# EAGLE design Flying5 (EAGLE 7.5.0)
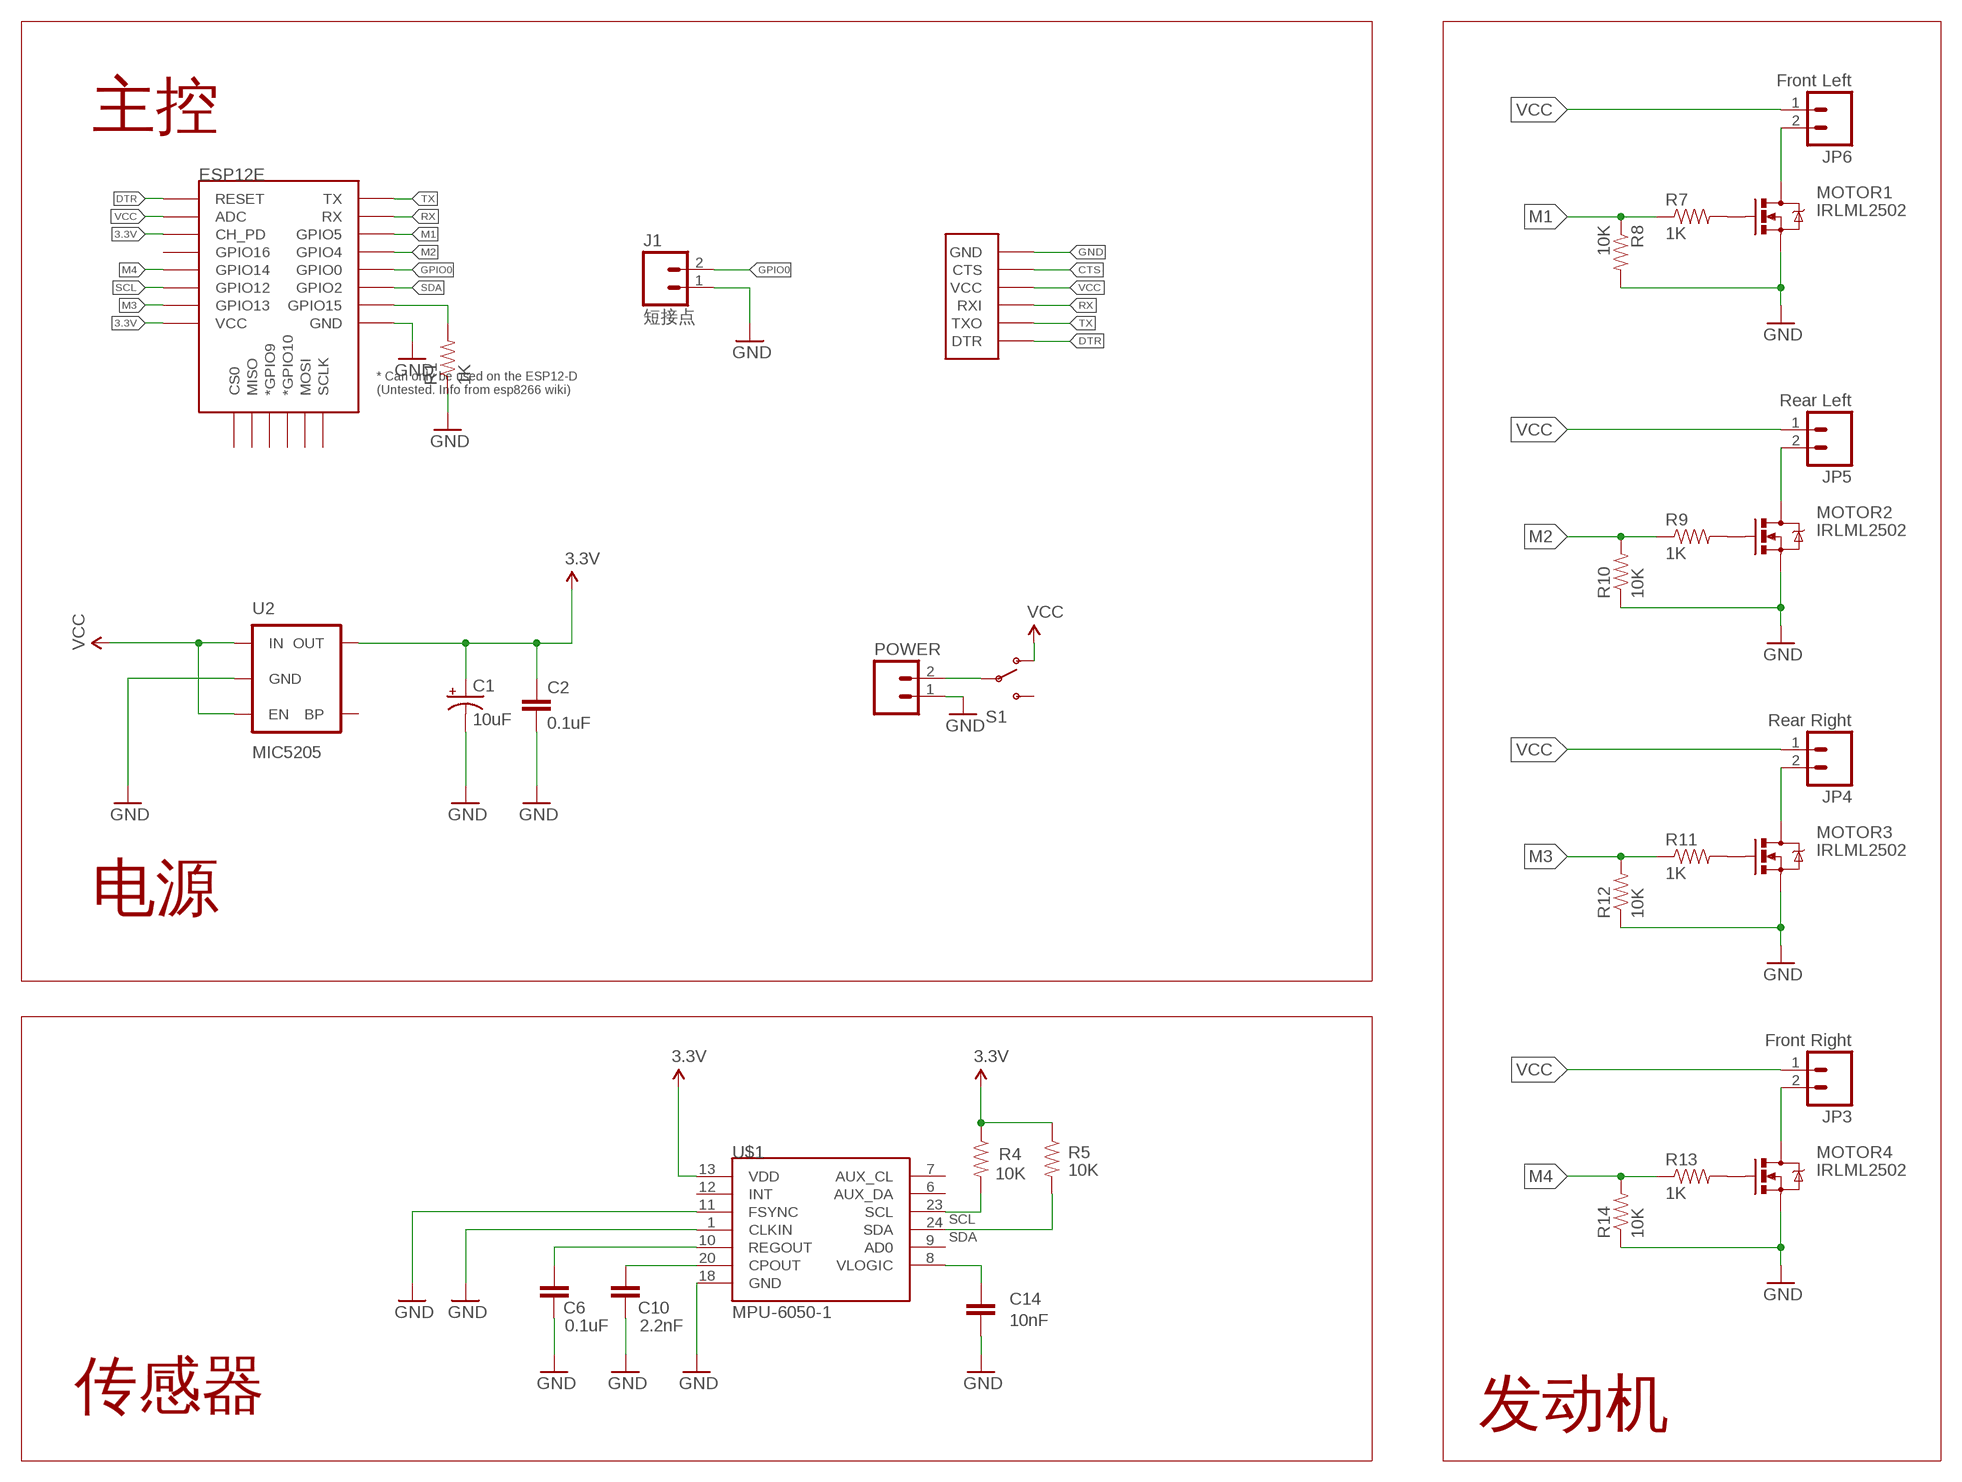
[diagram p0: schematic, sheet 1]

## Parts
C1  10uF  CAP_POL1206  [EIA3216]
C2  0.1uF  CAP0402-CAP  [0402-CAP]
C6  0.1uF  CAP0402-CAP  [0402-CAP]
C10  2.2nF  CAP0402-CAP  [0402-CAP]
C14  10nF  CAP0402-CAP  [0402-CAP]
ESP12E  ESP12ESMD  [ESP12E-SMD]
FTDI  FTDI_DEVICE  [FTDI_DEVICE_SIDE]
J1  短接点  M02PTH  [1X02]
JP3  Front Right  M02PTH3  [1X02_LONGPADS]
JP4  Rear Right  M02PTH3  [1X02_LONGPADS]
JP5  Rear Left  M02PTH3  [1X02_LONGPADS]
JP6  Front Left  M02PTH3  [1X02_LONGPADS]
MOTOR1  IRLML2502  MOSFET-NCHANNELBSS138  [SOT23]
MOTOR2  IRLML2502  MOSFET-NCHANNELBSS138  [SOT23]
MOTOR3  IRLML2502  MOSFET-NCHANNELBSS138  [SOT23]
MOTOR4  IRLML2502  MOSFET-NCHANNELBSS138  [SOT23]
POWER  M02PTH  [1X02]
R1  1K  RESISTOR0402-RES  [0402-RES]
R4  10K  RESISTOR0402-RES  [0402-RES]
R5  10K  RESISTOR0402-RES  [0402-RES]
R7  1K  RESISTOR0402-RES  [0402-RES]
R8  10K  RESISTOR0402-RES  [0402-RES]
R9  1K  RESISTOR0402-RES  [0402-RES]
R10  10K  RESISTOR0402-RES  [0402-RES]
R11  1K  RESISTOR0402-RES  [0402-RES]
R12  10K  RESISTOR0402-RES  [0402-RES]
R13  1K  RESISTOR0402-RES  [0402-RES]
R14  10K  RESISTOR0402-RES  [0402-RES]
S1  SWITCH-SPDT-SMD-A  [SWITCH-SPST-SMD-A]
U2  MIC5205  MIC52055V  [SOT23-5]
U$1  MPU-6050-1  [QFN-24-4MM2]

## Nets
3.3V: C1.A(+) C2.1 ESP12E.CH_PD ESP12E.VCC R4.1 R5.1 U2.5(OUT) U$1.13(VDD)
CTS: FTDI.P$5(CTS)
DTR: ESP12E.RESET FTDI.P$1(DTR)
GND: C1.C(-) C2.2 C6.1 C10.1 C14.1 ESP12E.GND FTDI.P$6(GND) J1.1 MOTOR1.2(S) MOTOR2.2(S) MOTOR3.2(S) MOTOR4.2(S) POWER.1 R1.1 R8.2 R10.1 R12.1 R14.1 U2.2(GND) U$1.1(CLKIN) U$1.11(FSYNC) U$1.18(GND)
GPIO0: ESP12E.GPIO0 J1.2
M1: ESP12E.GPIO5 R7.1 R8.1
M2: ESP12E.GPIO4 R9.1 R10.2
M3: ESP12E.GPIO13 R11.1 R12.2
M4: ESP12E.GPIO14 R13.1 R14.2
N$3: JP3.2 MOTOR4.3(D)
N$5: C14.2 U$1.8(VLOGIC)
N$6: POWER.2 S1.2(P)
N$8: JP4.2 MOTOR3.3(D)
N$12: JP5.2 MOTOR2.3(D)
N$14: JP6.2 MOTOR1.3(D)
N$16: ESP12E.GPIO15 R1.2
N$29: C6.2 U$1.10(REGOUT)
N$32: C10.2 U$1.20(CPOUT)
N$38: MOTOR1.1(G) R7.2
N$39: MOTOR2.1(G) R9.2
N$40: MOTOR3.1(G) R11.2
N$41: MOTOR4.1(G) R13.2
RX: ESP12E.RXD0(RX) FTDI.P$3(RXI)
SCL: ESP12E.GPIO12 R4.2 U$1.23(SCL)
SDA: ESP12E.GPIO2 R5.2 U$1.24(SDA)
TX: ESP12E.TXD0(TX) FTDI.P$2(TXO)
VCC: ESP12E.ADC FTDI.P$4(VCC) JP3.1 JP4.1 JP5.1 JP6.1 S1.1(O) U2.1(IN) U2.3(EN)
Unconnected: ESP12E.CS0 ESP12E.GPIO9(*GPIO9) ESP12E.GPIO10(*GPIO10) ESP12E.GPIO16 ESP12E.MISO ESP12E.MOSI ESP12E.SCLK S1.3(S) U2.4(BP) U$1.6(AUX_DA) U$1.7(AUX_CL) U$1.9(AD0) U$1.12(INT)

## Notes on the sheet
- 主控
- 电源
- 传感器 | 发动机

## Library data of the parts
C1 = SparkFun-Capacitors:CAP_POL: Capacitor Polarized These are standard SMD and PTH capacitors. Normally 10uF, 47uF, and 100uF in electrolytic and tantalum varieties. Always verify the external diameter of the through hole cap, it varies with capacity, voltage, and manufacturer. The EIA devices should be standard.
C2 C6 C10 C14 = SparkFun-Capacitors:CAP: Capacitor Standard 0603 ceramic capacitor, and 0.1" leaded capacitor.
ESP12E = esp8266modules:ESP12E: ESP12E Module
FTDI = SparkFun-Connectors:FTDI_DEVICE: Connector which mates to FTDI basic or FTDI cable.
J1 JP3-JP6 POWER = SparkFun-Connectors:M02: Standard 2-pin 0.1" header. Use with - straight break away headers ( PRT-00116) - right angle break away headers (PRT-00553) - swiss pins (PRT-00743) - machine pins (PRT-00117) - female headers (PRT-00115) Molex polarized connector foot print use with: PRT-08233 with associated crimp pins and housings. 2.54_SCREWTERM for use with PRT-10571. 3.5mm Screw Terminal footprints for PRT-08084 5mm Screw Terminal footprints for use with PRT-08432
MOTOR1-MOTOR4 = SparkFun-DiscreteSemi:MOSFET-NCHANNEL: Common NMOSFET Parts MFG P/N Store ID Prod ID FDD8780 TRANS-09984 SI7820DN TRANS-11055 FDS6630A IC-08089 2N7002PW TRANS-11151 FQP30N06L COM-10213 TRANS-10060 BSS123LT1G TRANS-08345 BSS138 TRANS-00830 BS170 2N7000; PROD_ID: TRANS-00830
R1 R4 R5 R7-R14 = SparkFun-Passives:RESISTOR: Resistor Basic schematic elements and footprints for 0603, 1206, and PTH resistors.
S1 = SparkFun-Electromechanical:SWITCH-SPDT: SPDT Switch Simple slide switch, Spark Fun Electronics SKU : COM-00102 DPDT SMT slide switch, AYZ0202, SWCH-08179; PROD_ID: SWCH-10651
U2 = SparkFun-PowerIC:MIC5205: MIC5205 150mA vreg 3.3V - VREG-00822 5V - VREG-00823; PROD_ID: VREG-00823
U$1 = Testing:MPU-6050

## Board
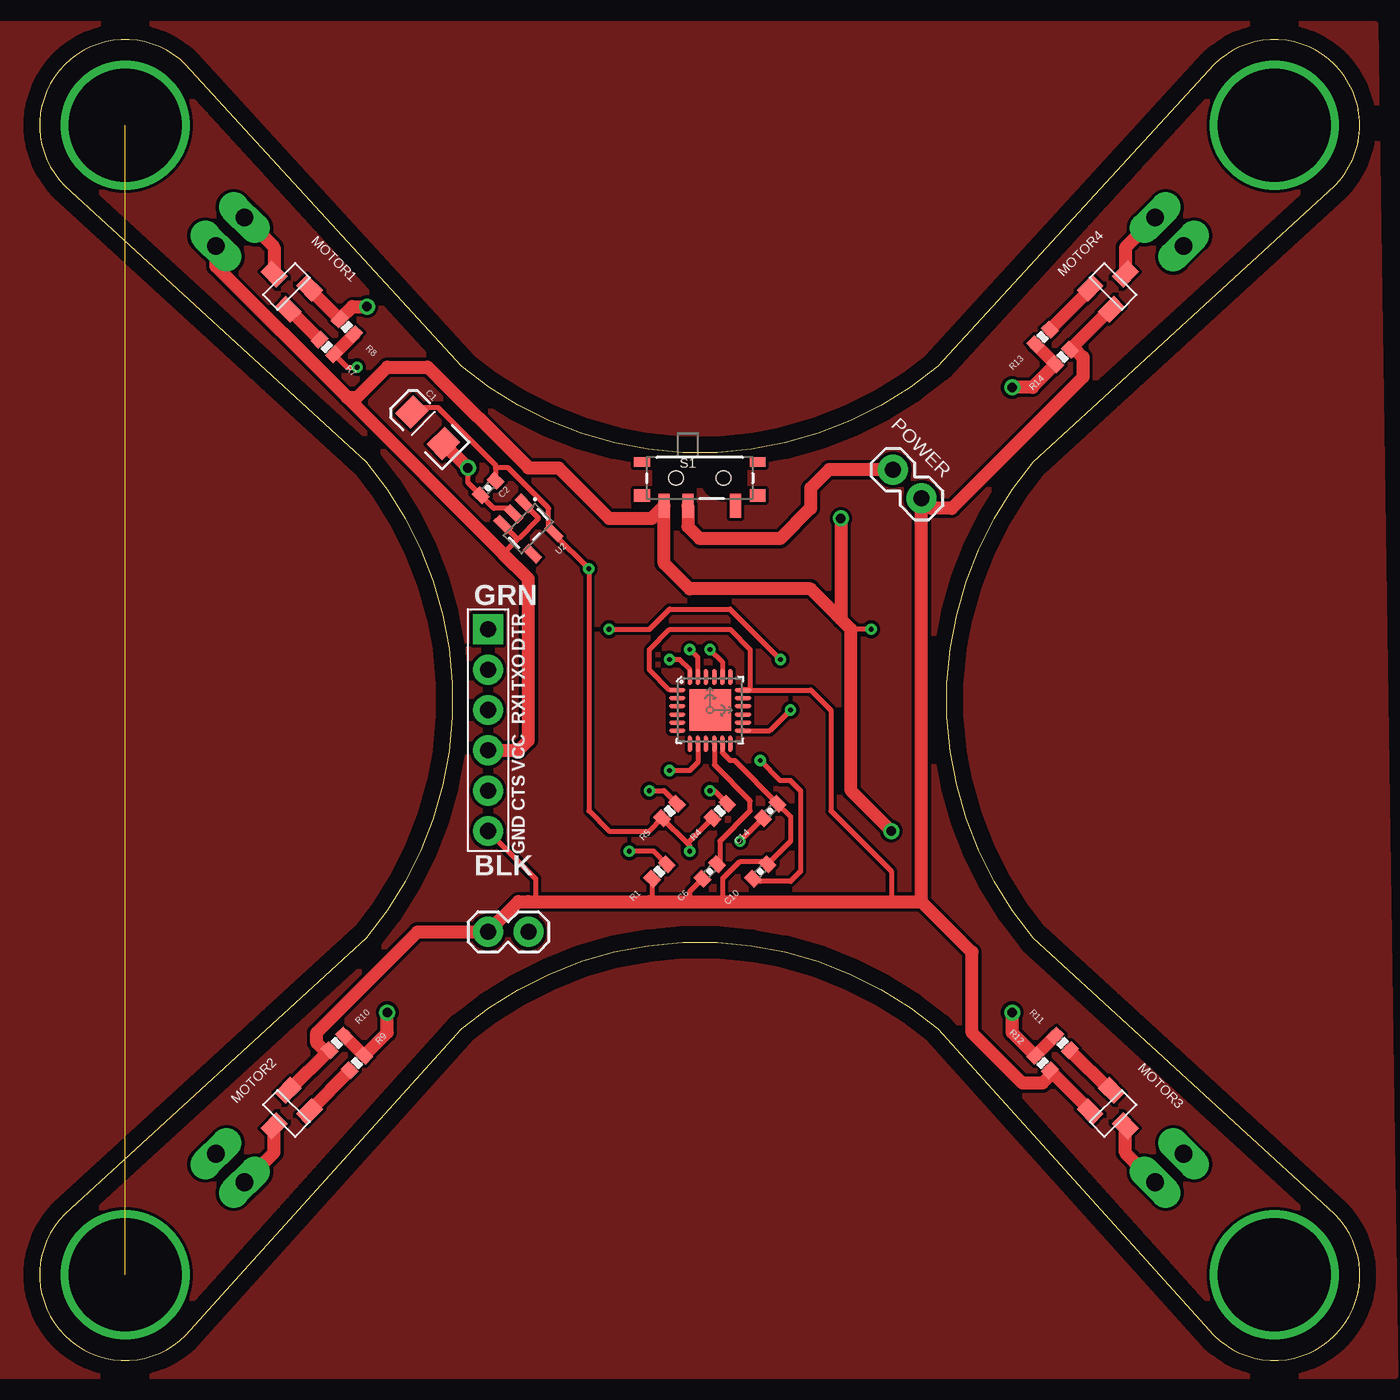
[diagram p1: board, top side]
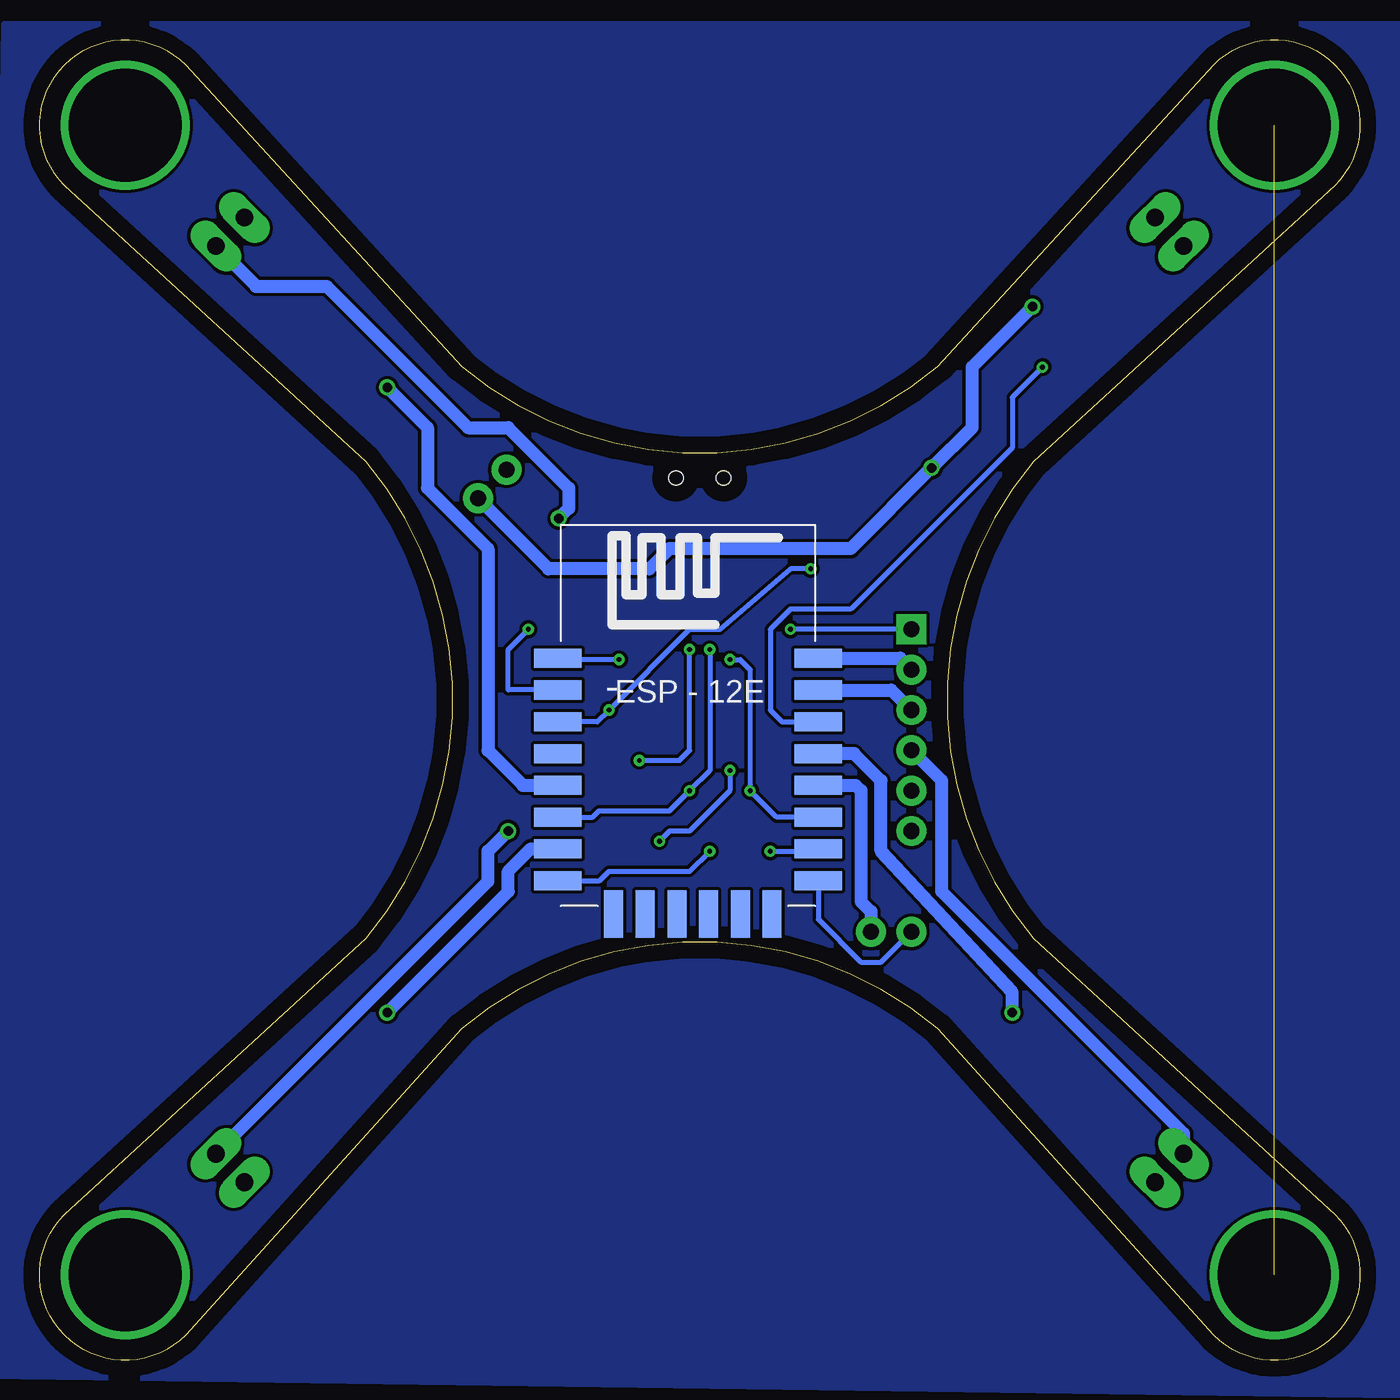
[diagram p2: board, bottom side, seen from below]

Size 83.15 x 83.15 mm. Coordinates in mm from the lower left corner, seen from the top.
Outline: 1.57,1.57 arc90 9.19,1.57 26.57,20.88 arc-80 56.57,20.88 73.96,1.57 arc90 81.57,1.57 arc90 81.58,9.19 62.59,26.57 arc-80 62.59,56.57 81.57,73.95 arc90 81.57,81.57 arc90 73.96,81.58 56.57,62.59 arc-80 26.57,62.59 9.2,81.57 arc90 1.57,81.57 arc90 1.57,73.96 20.56,56.57 arc-80 20.56,26.57 1.57,9.19 arc90 1.57,1.57
Copper layers (1*16): Top 0.035mm / dielectric 1.5mm / Bottom 0.035mm
Design rules "default": minimum track width 10mil, minimum drill 24mil, track to track 8mil, track to pad 8mil, pad to pad 8mil, via to via 8mil, smd to smd 8mil, copper to edge 40mil, drill to drill 8mil, minimum pad ring 10mil, minimum via ring 8mil, stop-mask expansion 4mil, vias tented up to drill 0mil, thermal gap 10mil

### Footprints (pad centres in the part's own frame; a part is rotated, then mirrored left to right if it is on the bottom)
EIA3216 = smd 1.4 x 1.6: A 1.4,0; C -1.4,0
0402-CAP = smd 0.7 x 0.9: 1 -0.65,0; 2 0.65,0
ESP12E-SMD = smd 3 x 1.2: ADC -8.3,3.8; CH_PD -8.3,1.8; GND 8.1,-8.2; GPIO0 8.1,-2.2; GPIO2 8.1,-4.2; GPIO4 8.1,-0.2; GPIO5 8.1,1.8; GPIO12 -8.3,-4.2; GPIO13 -8.3,-6.2; GPIO14 -8.3,-2.2; GPIO15 8.1,-6.2; GPIO16 -8.3,-0.2; RESET -8.3,5.8; RXD0 8.1,3.8; TXD0 8.1,5.8; VCC -8.3,-8.2 | smd 1.2 x 3: CS0 -4.8,-10.3; GPIO9 -0.8,-10.3; GPIO10 1.2,-10.3; MISO -2.8,-10.3; MOSI 3.2,-10.3; SCLK 5.2,-10.3
FTDI_DEVICE_SIDE = drill 1.016 pad 1.88 square: P$1 -6.35,0 | drill 1.016 pad 1.88: P$2 -3.81,0; P$3 -1.27,0; P$4 1.27,0; P$5 3.81,0; P$6 6.35,0
1X02 = drill 1.016 pad 1.88: 1 0,0; 2 2.54,0
1X02_LONGPADS = drill 1.118 pad 1.88 long: 1 0,0; 2 2.54,0
SOT23 = smd 1 x 1.4: 1 -0.95,-1.1; 2 0.95,-1.1; 3 0,1.1
0402-RES = smd 0.7 x 0.9: 1 -0.65,0; 2 0.65,0
SWITCH-SPST-SMD-A = smd 0.7 x 1.5: 1 -2.25,-1.75; 2 -0.75,-1.75; 3 2.25,-1.75 | smd 1 x 0.6: GND1 -3.65,1; GND3 3.65,1 | smd 1 x 0.8: GND2 -3.65,-1.1; GND4 3.65,-1.1 | hole 0.9: -1.5,0; 1.5,0
SOT23-5 = smd 0.55 x 1.2: 1 -0.95,-1.3; 2 0,-1.3; 3 0.95,-1.3; 4 0.95,1.3; 5 -0.95,1.3
QFN-24-4MM2 = smd 1.016 x 0.254: 1 -2.066,1.257; 2 -2.066,0.75; 3 -2.066,0.247; 4 -2.066,-0.287; 5 -2.066,-0.792; 6 -2.066,-1.297; 13 2.086,-1.297; 14 2.086,-0.792; 15 2.086,-0.287; 16 2.086,0.247; 17 2.086,0.75; 18 2.086,1.257 | smd 0.254 x 1.016: 7 -1.267,-2.122; 8 -0.762,-2.122; 9 -0.258,-2.122; 10 0.278,-2.122; 11 0.78,-2.122; 12 1.287,-2.122; 19 1.287,2.082; 20 0.78,2.082; 21 0.278,2.082; 22 -0.258,2.082; 23 -0.762,2.082; 24 -1.267,2.082 | smd 2.616 x 2.616: P$1 0.02,-0.01

### Placement (x,y rotation side)
C1  24.43,58.72 135 top
C2  28.24,54.91 225 top
C6  42.21,30.78 45 top
C10  45.39,30.78 225 top
C14  46.02,34.59 225 top
ESP12E  42.21,38.4 0 bottom
FTDI  28.24,39.67 270 top
J1  28.24,26.97 0 top
JP3  72.06,70.15 135 top
JP4  72.06,13 225 top
JP5  11.1,13 315 top
JP6  11.1,70.15 45 top
MOTOR1  15.54,67.61 45 top
MOTOR2  15.54,15.54 135 top
MOTOR3  67.61,15.54 225 top
MOTOR4  67.61,67.61 315 top
POWER  55.55,54.28 135 top
R1  39.04,30.78 45 top
R4  42.85,34.59 45 top
R5  39.67,34.59 45 top
R7  18.08,63.8 135 top
R8  19.35,65.07 135 top
R9  19.99,18.72 225 top
R10  18.72,19.99 45 top
R11  64.44,19.99 315 top
R12  63.17,18.72 135 top
R13  63.17,64.44 45 top
R14  64.44,63.17 225 top
S1  41.58,55.55 0 top
U2  30.78,52.37 225 top
U$1  42.21,40.94 0 top

### Tracks (layer width: path | path; a pad name or v marks a point on that pad's centre or on a via)
3.3V  (via drill 0.3)
  Top 0.305: C1.A 23.72,59.99 25.07,59.99 28.7,56.36 28.7,56.18 | 28.7,56.18 C2.1 | 28.7,56.18 29.51,56.18 32.05,53.64 32.05,52.45 U2.5 32.37,52.05 v34.59,49.83 34.59,34.59 35.86,33.32 38.4,33.32 R5.1 40.8,32.55 | v40.94,32.05 40.94,32.4 40.8,32.55 | U$1.13 46,39.65 v47.29,40.94 | R4.1 40.8,32.55
  Bottom 0.305: ESP12E.VCC 47.87,30.2 47.29,30.78 42.21,30.78 v40.94,32.05 | ESP12E.CH_PD 48.03,40.2 v47.29,40.94 42.21,46.02 40.31,46.02 35.86,49.83 v34.59,49.83
DTR  (via drill 0.3)
  Top 0.305: v35.86,46.02 38.4,46.02 39.67,47.29 43.48,47.29 v46.66,44.12
  Bottom 0.305: FTDI.P$1 v35.86,46.02 | v46.66,44.12 50.43,44.12 ESP12E.RESET
GND  (via drill 0.6)
  Top 0.305: U$1.11 42.99,38.26 43.48,37.77 43.77,37.77 C14.1 47.29,34.24 47.29,32.69 C10.1 45.67,31.42 44.12,31.42 43.02,30.32 43.02,28.88 43.48,28.88 | FTDI.P$6 31.24,30.32 31.24,28.88 30.78,28.88 | U2.2 29.51,53.64 | 29.51,53.64 | 29.51,53.64 28.59,53.64 C2.2 26.97,55.26 v26.97,56.18 | 53.64,28.88 53.64,30.78 49.83,34.59 49.83,40.94 48.58,42.2 U$1.18 44.75,42.21 44.75,44.75 43.48,46.02 39.67,46.02 38.4,44.75 38.4,43.48 39.69,42.2 U$1.1 | R1.1 38.58,29.05 38.4,28.88 | C6.1 40.94,29.51 40.94,28.88 | C1.C
  Top 0.813: MOTOR4.2 67.43,66.16 65.07,63.8 | MOTOR2.2 15.72,16.99 R10.1 17.91,19.53 17.45,19.99 17.45,20.62 23.8,26.97 J1.1 30.15,28.88 30.78,28.88 38.4,28.88 40.94,28.88 43.48,28.88 53.64,28.88 55.55,28.88 | MOTOR3.2 66.16,15.72 R12.1 63.63,17.91 63.17,17.45 61.9,17.45 58.72,20.62 58.72,25.7 55.55,28.88 | MOTOR1.2 16.99,67.43 R8.2 19.7,66.34 v20.62,66.34 | R14.1 65.07,63.8 | 65.07,63.8 65.71,63.17 65.71,61.9 57.45,53.64 56.18,53.64 POWER.1 55.55,28.88 | v26.97,56.18 | v26.97,56.18 C1.C
  Bottom 0.305: ESP12E.GND 34.11,27.76 31.42,25.07 30.15,25.07 J1.1
  Bottom 0.813: v20.62,66.34 24.43,62.53 24.43,58.72 v26.97,56.18 32.05,51.1 43.48,51.1 44.75,49.83 51.1,49.83 POWER.1
GPIO0
  Bottom 0.813: ESP12E.GPIO0 31.76,36.2 31.42,35.86 31.42,28.88 30.78,28.24 J1.2
M1  (via drill 0.3)
  Top 0.305: R7.1 19.35,62.53 v19.99,62.53
  Top 0.813: R7.1 R8.1
  Bottom 0.305: v19.99,62.53 21.89,60.63 21.89,57.45 32.05,47.29 35.86,47.29 37.13,46.02 37.13,40.94 36.39,40.2 ESP12E.GPIO5
M2  (via drill 0.6)
  Top 0.813: R10.2 R9.1 21.89,20.62 v21.89,21.89
  Bottom 0.813: v21.89,21.89 21.89,23.16 30.15,32.05 30.15,36.5 31.85,38.2 ESP12E.GPIO4
M3  (via drill 0.6)
  Top 0.813: R11.1 R12.2 61.26,20.62 v61.26,21.89
  Bottom 0.813: v61.26,21.89 53.64,29.51 53.64,30.78 52.22,32.2 ESP12E.GPIO13
M4  (via drill 0.6)
  Top 0.813: R13.1 R14.2 62.53,61.26 v61.26,61.26
  Bottom 0.813: v61.26,61.26 58.72,58.72 58.72,54.91 54.91,51.1 54.91,38.4 52.71,36.2 ESP12E.GPIO14
N$1  (via drill 7.11)  (1 unrouted)
  other vias: 5.38,77.77 5.38,5.38
N$2  (via drill 7.11)
  other vias: 77.77,77.77
N$3
  Top 0.813: JP3.2 68.39,70.08 MOTOR4.3
N$4  (via drill 7.11)
  other vias: 77.77,5.38
N$5  (via drill 0.3)
  Top 0.305: U$1.8 41.45,37.64 40.94,37.13 v39.67,37.13 | v44.12,32.69 C14.2
  Bottom 0.305: v39.67,37.13 39.67,35.86 42.21,33.32 43.48,33.32 v44.12,32.69
N$6
  Top 0.813: S1.2 40.83,52.49 41.58,51.74 46.66,51.74 48.56,53.64 48.56,54.91 49.72,56.07 POWER.2
N$8
  Top 0.813: JP4.2 68.39,13.08 MOTOR3.3
N$9
  pour Top: -3.51,-0.97 85.39,-0.97 84.12,84.12 -4.78,84.12
N$10
  pour Bottom: -4.78,84.12 -4.78,-2.24 86.66,-0.97 85.39,84.12
N$12
  Top 0.813: JP5.2 14.76,13.08 MOTOR2.3
N$14
  Top 0.813: JP6.2 14.76,70.08 MOTOR1.3
N$16  (via drill 0.3)
  Top 0.305: R1.2 38.69,32.05 v37.13,32.05
  Bottom 0.305: v37.13,32.05 34.26,32.05 ESP12E.GPIO15
N$29
  Top 0.305: U$1.10 42.49,37.49 44.75,35.23 44.75,34.59 42.85,32.69 42.85,31.42 C6.2
N$32  (via drill 0.3)
  Top 0.305: C10.2 45.21,30.32 45.39,30.15 47.29,30.15 47.93,30.78 47.93,35.86 47.29,36.5 46.66,36.5 v45.39,37.77 | v42.21,44.75 42.99,43.97 U$1.20
  Bottom 0.305: v45.39,37.77 42.85,37.77 42.21,38.4 v42.21,44.75
N$38
  Top 0.813: MOTOR1.1 15.72,66.16 R7.2
N$39
  Top 0.813: MOTOR2.1 16.99,15.72 R9.2
N$40
  Top 0.813: MOTOR3.1 67.43,16.99 R11.2
N$41
  Top 0.813: MOTOR4.1 66.16,67.43 R13.2
RX
  Bottom 0.813: ESP12E.RXD0 29.5,42.2 FTDI.P$3
SCL  (via drill 0.3)
  Top 0.305: U$1.23 41.45,44.24 v40.94,44.75 | v42.21,35.86 42.5,35.86 R4.2
  Bottom 0.305: v40.94,44.75 40.94,37.13 v42.21,35.86 43.48,34.59 47.93,34.59 48.32,34.2 ESP12E.GPIO12
SDA  (via drill 0.3)
  Top 0.305: U$1.24 40.95,43.48 40.31,44.12 v39.67,44.12 | R5.2 39.32,35.86 v38.4,35.86
  Bottom 0.305: ESP12E.GPIO2 36.74,34.2 v38.4,35.86 38.4,43.48 39.04,44.12 v39.67,44.12
TX
  Bottom 0.813: ESP12E.TXD0 28.96,44.2 FTDI.P$2
VCC  (via drill 0.3, 0.6)
  Top 0.305: U2.1 30.53,53.89 31.42,53.01 30.15,51.74 30.07,51.74 | 30.07,51.74 U2.3 | 30.07,51.74 30.07,51.66 29.19,50.78 | v52.37,46.02 51.1,46.02
  Top 0.813: JP6.1 11.1,68.88 19.35,60.63 | 19.35,60.63 19.99,60.63 21.89,62.53 24.43,62.53 30.78,56.18 32.69,56.18 35.86,53.01 38.54,53.01 S1.1 39.33,50.18 40.94,48.56 48.56,48.56 50.47,46.66 | v53.64,33.32 51.1,35.86 51.1,46.02 50.47,46.66 | FTDI.P$4 30.15,38.4 30.78,39.04 30.78,49.2 29.19,50.78 19.35,60.63 | v50.47,53.01 50.47,46.66
  Bottom 0.305: ESP12E.ADC 53.64,42.21 53.64,44.75 v52.37,46.02
  Bottom 0.813: JP5.1 11.1,14.27 26.34,29.51 26.34,36.5 FTDI.P$4 | JP3.1 69.52,67.61 65.07,67.61 56.18,58.72 53.64,58.72 49.83,54.91 49.83,53.64 v50.47,53.01 | JP4.1 54.91,30.15 54.91,32.05 v53.64,33.32

### Text on the board
bNames: -
tDocu: www.flying5.com